# Altium schematic sheet Oscilador.SchDoc
size A4
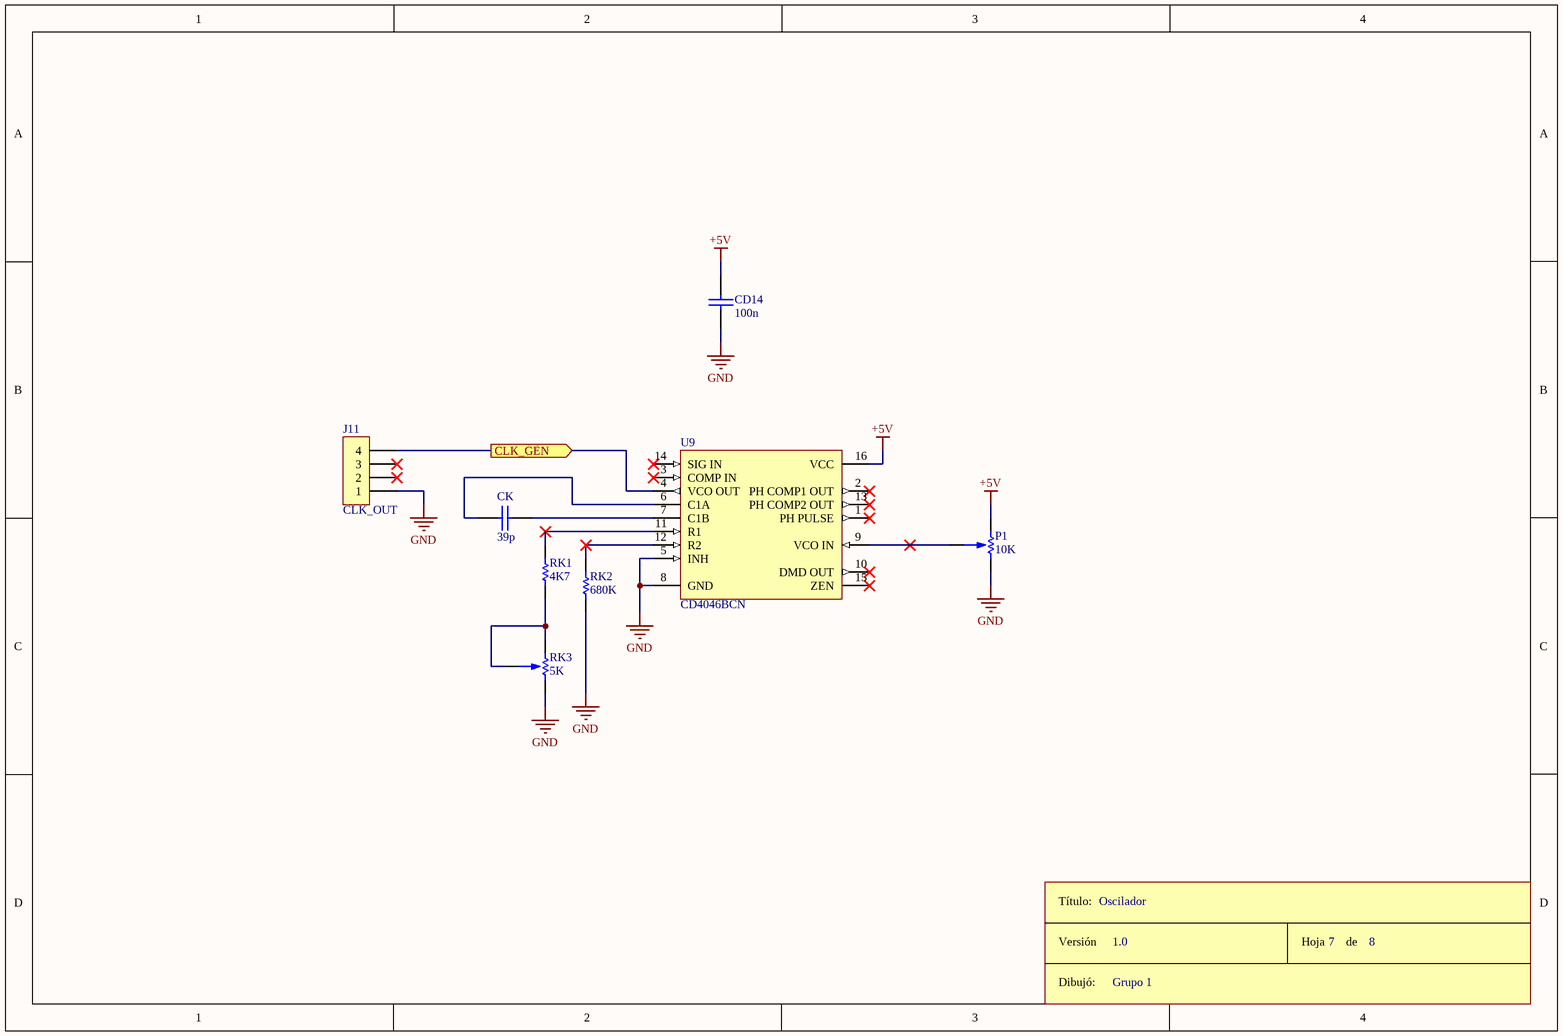
[diagram p0: Oscilador.SchDoc]

## Parts
CD14  100n  [CAP100]
CK  39p  [CAP100]
J11  CLK_OUT  [SIP4]
P1  10K  [PRESET V]
RK1  4K7  [RES300]
RK2  680K  [RES300]
RK3  5K  [PRESET V]
ROT7  Rótulo  (value not drawn)
U9  CD4046BCN  [N16E]

## Ports
CLK_GEN (out)

## Nets
+5V: CD14.1 P1.3 U9.16(VCC)
GND: CD14.2 J11.1 P1.1 RK2.1 RK3.1 U9.5(INH) U9.8(GND)
CLK_GEN: J11.4 U9.4(VCO_OUT) ; port CLK_GEN
NetCK_1: CK.1 U9.6(C1A)
NetCK_2: CK.2 U9.7(C1B)
NetP1_2: P1.2 U9.9(VCO_IN)
NetRK1_1: RK1.1 RK3.2 RK3.3
NetRK1_2: RK1.2 U9.11(R1)
NetRK2_2: RK2.2 U9.12(R2)

Not connected (* = marked no-connect by the designer): J11 2* 3*; U9 1(PH_PULSE)* 2(PH_COMP1_OUT)* 3(COMP_IN)* 10(DMD_OUT)* 13(PH_COMP2_OUT)* 14(SIG_IN)* 15(ZEN)*

## Notes on the sheet
- Oscilador
- 1.0
- Grupo 1
- 7
- 8
- (in symbol Rótulo) Título:; Versión; Hoja       de; Dibujó:

## Library data of the parts
CD14 CK = CAP
J11 = CON4
P1 RK3 = PRESET
RK1 RK2 = RES
U9 = CD4046BCN: Micropower Phase-Locked Loop; Published: 17-Jul-2002; LatestRevisionDate: 04-Mar-2005; LatestRevisionNote: Stylized 3D Model Added.; DatasheetVersion: Jan-1999; PackageVersion: 2000; PackageReference: N16E; Publisher: Altium Limited; PackageDescription: DIP; 16 Leads; Row Spacing 7.62 mm; Pitch 2.54 mm; ComponentLink1Description: Manufacturer Link; ComponentLink1URL: http://www.fairchildsemi.com/; ComponentLink2Description: Datasheet; ComponentLink2URL: http://www.fairchildsemi.com/ds/CD%2FCD4046BC.pdf